# Altium schematic sheet MainSheet.SchDoc
size A4
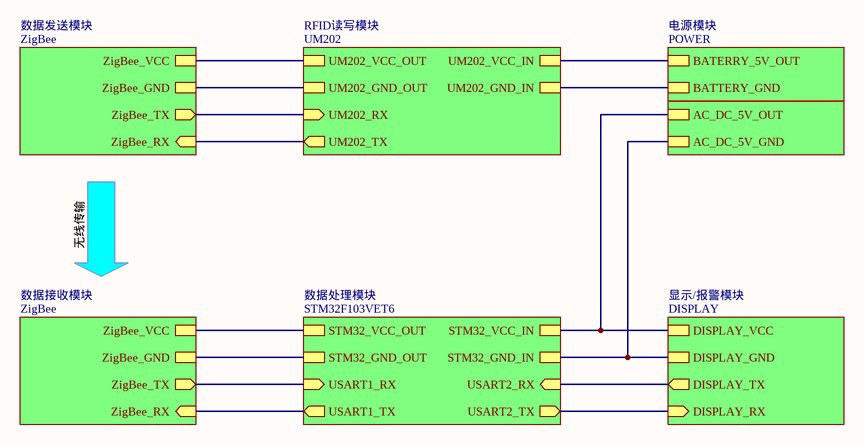
[diagram p0: MainSheet.SchDoc]

## Sub-sheets
RFID读写模块 = UM202: UM202_RX (in), UM202_TX (out), UM202_VCC_OUT, UM202_GND_OUT, UM202_VCC_IN, UM202_GND_IN
数据发送模块 = ZigBee: ZigBee_TX (out), ZigBee_RX (in), ZigBee_VCC, ZigBee_GND
数据处理模块 = STM32F103VET6: USART1_TX (out), USART1_RX (in), USART2_TX (out), USART2_RX (in), STM32_VCC_IN, STM32_GND_IN, STM32_VCC_OUT, STM32_GND_OUT
数据接收模块 = ZigBee: ZigBee_TX (out), ZigBee_RX (in), ZigBee_VCC, ZigBee_GND
显示/报警模块 = DISPLAY: DISPLAY_TX (out), DISPLAY_RX (in), DISPLAY_VCC, DISPLAY_GND
电源模块 = POWER: AC_DC_5V_OUT, BATERRY_5V_OUT, AC_DC_5V_GND, BATTERY_GND

## Nets
(unnamed): sheet 数据接收模块/ZigBee_TX, sheet 数据处理模块/USART1_RX
(unnamed): sheet 数据接收模块/ZigBee_RX, sheet 数据处理模块/USART1_TX
(unnamed): sheet 数据接收模块/ZigBee_VCC, sheet 数据处理模块/STM32_VCC_OUT
(unnamed): sheet 数据接收模块/ZigBee_GND, sheet 数据处理模块/STM32_GND_OUT
(unnamed): sheet 数据处理模块/USART2_TX, sheet 显示/报警模块/DISPLAY_RX
(unnamed): sheet 数据处理模块/USART2_RX, sheet 显示/报警模块/DISPLAY_TX
(unnamed): sheet 数据处理模块/STM32_VCC_IN, sheet 显示/报警模块/DISPLAY_VCC, sheet 电源模块/AC_DC_5V_OUT
(unnamed): sheet 数据处理模块/STM32_GND_IN, sheet 显示/报警模块/DISPLAY_GND, sheet 电源模块/AC_DC_5V_GND
(unnamed): sheet RFID读写模块/UM202_RX, sheet 数据发送模块/ZigBee_TX
(unnamed): sheet RFID读写模块/UM202_TX, sheet 数据发送模块/ZigBee_RX
(unnamed): sheet RFID读写模块/UM202_VCC_OUT, sheet 数据发送模块/ZigBee_VCC
(unnamed): sheet RFID读写模块/UM202_GND_OUT, sheet 数据发送模块/ZigBee_GND
(unnamed): sheet RFID读写模块/UM202_VCC_IN, sheet 电源模块/BATERRY_5V_OUT
(unnamed): sheet RFID读写模块/UM202_GND_IN, sheet 电源模块/BATTERY_GND

## Notes on the sheet
- 无线传输